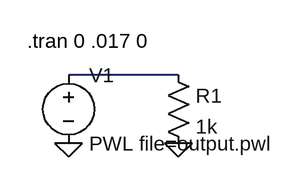
[diagram p0: schematic testpwl.asc]
testpwl.asc, the LTspice schematic file:
Version 4
SHEET 1 880 680
WIRE 208 112 80 112
FLAG 80 192 0
FLAG 208 192 0
SYMBOL voltage 80 96 R0
WINDOW 123 0 0 Left 2
WINDOW 39 0 0 Left 2
SYMATTR InstName V1
SYMATTR Value PWL file=output.pwl
SYMBOL res 192 96 R0
SYMATTR InstName R1
SYMATTR Value 1k
TEXT 32 72 Left 2 !.tran 0 .017 0

The netlist it stands for:
* testpwl.asc
V1 N001 0 PWL file=output.pwl
R1 N001 0 1k
.tran 0 .017 0
.backanno
.end